# Altium project Flat_Log_UI.PrjPcb
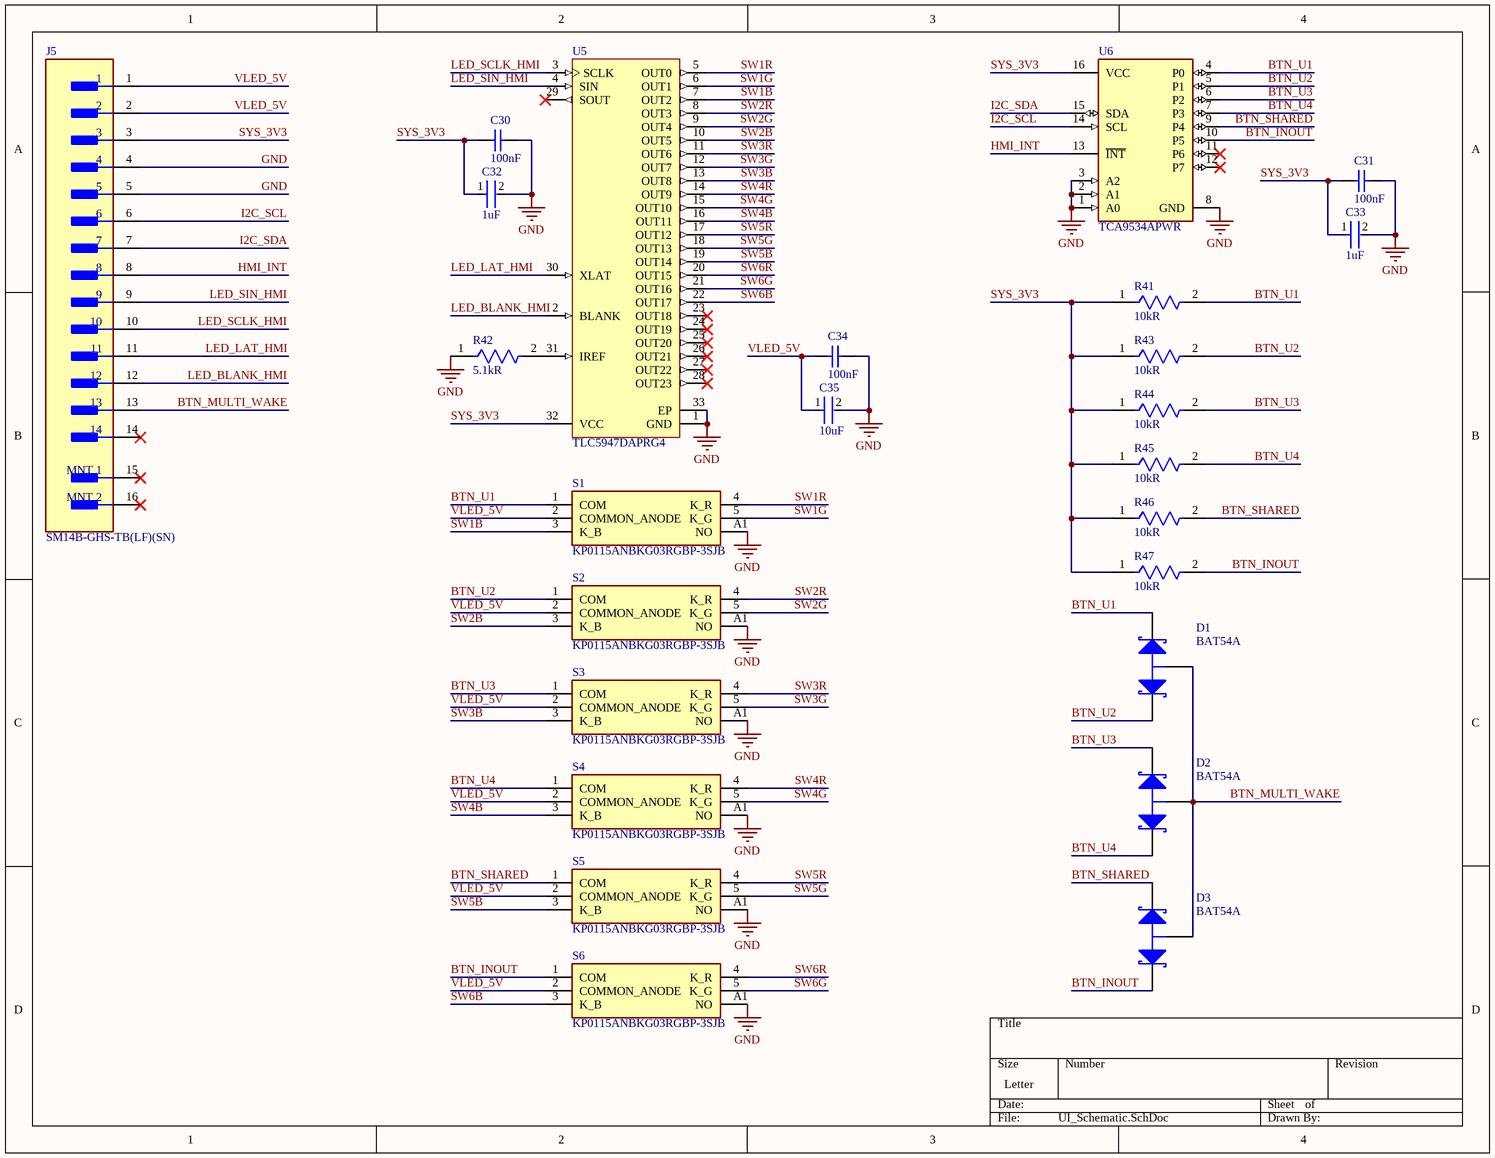
[diagram p0: UI_Schematic.SchDoc]
1 sheet, 25 parts. Net scope: global (net labels, ports and power ports of the same name join across sheets).
Board file: UI_PCB.PcbDoc

## Sheet UI_Schematic.SchDoc
size Letter; SheetNumber: 2; SheetTotal: 2

### Parts
C30  100nF  [CAPC1608X90X35ML10T15]
C31  100nF  [CAPC1608X90X35ML10T15]
C32  1uF  [FP-GRT188-0_1-e0_2_0_5-IPC_C]
C33  1uF  [FP-GRT188-0_1-e0_2_0_5-IPC_C]
C34  100nF  [CAPC1608X90X35ML10T15]
C35  10uF  [FP-GRM21B-0_15-IPC_A]
D1  BAT54A  [NXP-SOT23-3_V]
D2  BAT54A  [NXP-SOT23-3_V]
D3  BAT54A  [NXP-SOT23-3_V]
J5  SM14B-GHS-TB(LF)(SN)  [FP-SM14B-GHS-TB_LF_SN-MFG]
R41  10kR  [FP-AC0603-IPC_A]
R42  5.1kR  [FP-AT0603-IPC_B]
R43  10kR  [FP-AC0603-IPC_A]
R44  10kR  [FP-AC0603-IPC_A]
R45  10kR  [FP-AC0603-IPC_A]
R46  10kR  [FP-AC0603-IPC_A]
R47  10kR  [FP-AC0603-IPC_A]
S1  KP0115ANBKG03RGBP-3SJB  [KP0115ANBKG03RGBP3SJB]
S2  KP0115ANBKG03RGBP-3SJB  [KP0115ANBKG03RGBP3SJB]
S3  KP0115ANBKG03RGBP-3SJB  [KP0115ANBKG03RGBP3SJB]
S4  KP0115ANBKG03RGBP-3SJB  [KP0115ANBKG03RGBP3SJB]
S5  KP0115ANBKG03RGBP-3SJB  [KP0115ANBKG03RGBP3SJB]
S6  KP0115ANBKG03RGBP-3SJB  [KP0115ANBKG03RGBP3SJB]
U5  TLC5947DAPRG4  [TI-DAP32-3810X3710TP_N]
U6  TCA9534APWR  [FP-PW0016A-MFG]

### Nets
GND: C30.1 C31.1 C32.2 C33.2 C34.1 C35.2 J5.4 J5.5 R42.1 S1.A1(NO) S2.A1(NO) S3.A1(NO) S4.A1(NO) S5.A1(NO) S6.A1(NO) U5.1(GND) U5.33(EP) U6.1(A0) U6.2(A1) U6.3(A2) U6.8(GND)
BTN_INOUT: D3.2(K) R47.2 S6.1(COM) U6.10(P5)
BTN_MULTI_WAKE: D1.3(A) D2.3(A) D3.3(A) J5.13
BTN_SHARED: D3.1(K) R46.2 S5.1(COM) U6.9(P4)
BTN_U1: D1.1(K) R41.2 S1.1(COM) U6.4(P0)
BTN_U2: D1.2(K) R43.2 S2.1(COM) U6.5(P1)
BTN_U3: D2.1(K) R44.2 S3.1(COM) U6.6(P2)
BTN_U4: D2.2(K) R45.2 S4.1(COM) U6.7(P3)
HMI_INT: J5.8 U6.13(~{INT})
I2C_SCL: J5.6 U6.14(SCL)
I2C_SDA: J5.7 U6.15(SDA)
LED_BLANK_HMI: J5.12 U5.2(BLANK)
LED_LAT_HMI: J5.11 U5.30(XLAT)
LED_SCLK_HMI: J5.10 U5.3(SCLK)
LED_SIN_HMI: J5.9 U5.4(SIN)
SW1B: S1.3(K_B) U5.7(OUT2)
SW1G: S1.5(K_G) U5.6(OUT1)
SW1R: S1.4(K_R) U5.5(OUT0)
SW2B: S2.3(K_B) U5.10(OUT5)
SW2G: S2.5(K_G) U5.9(OUT4)
SW2R: S2.4(K_R) U5.8(OUT3)
SW3B: S3.3(K_B) U5.13(OUT8)
SW3G: S3.5(K_G) U5.12(OUT7)
SW3R: S3.4(K_R) U5.11(OUT6)
SW4B: S4.3(K_B) U5.16(OUT11)
SW4G: S4.5(K_G) U5.15(OUT10)
SW4R: S4.4(K_R) U5.14(OUT9)
SW5B: S5.3(K_B) U5.19(OUT14)
SW5G: S5.5(K_G) U5.18(OUT13)
SW5R: S5.4(K_R) U5.17(OUT12)
SW6B: S6.3(K_B) U5.22(OUT17)
SW6G: S6.5(K_G) U5.21(OUT16)
SW6R: S6.4(K_R) U5.20(OUT15)
SYS_3V3: C30.2 C31.2 C32.1 C33.1 J5.3 R41.1 R43.1 R44.1 R45.1 R46.1 R47.1 U5.32(VCC) U6.16(VCC)
VLED_5V: C34.2 C35.1 J5.1 J5.2 S1.2(COMMON_ANODE) S2.2(COMMON_ANODE) S3.2(COMMON_ANODE) S4.2(COMMON_ANODE) S5.2(COMMON_ANODE) S6.2(COMMON_ANODE)
NetR42_2: R42.2 U5.31(IREF)

Not connected (* = marked no-connect by the designer): J5 14* 15(MNT_1)* 16(MNT_2)*; U5 23(OUT18)* 24(OUT19)* 25(OUT20)* 26(OUT21)* 27(OUT22)* 28(OUT23)* 29(SOUT)*; U6 11(P6)* 12(P7)*

### Library data of the parts
C30 C31 C34 = CMP-2006-02375-5: Chip Capacitor, 100 nF, +/- 10%, 50 V, -55 to 125 degC, 0603 (1608 Metric), RoHS, Tape and Reel; Manufacturer: Murata; Voltage Rating: 50 V; Min Operating Temperature: -55 degC; ComponentLink1URL: http://www.murata.com/; PackageReference: 0603; Max Operating Temperature: 125 degC; ComponentLink1Description: Manufacturer URL; ComponentLink2Description: Datasheet; Packaging: Tape and Reel; PackageDescription: 2-Pin Surface Mount Device, Body 1.6 x 0.8 mm; Height: 0.8 mm; Mounting Technology: Surface Mount; Mount: Surface Mount; Length: 1.6 mm; ComponentLink2URL: http://psearch.en.murata.com/capacitor/product/GCM188R71H104KA57%23.pdf; Package Quantity: 4000; REACH SVHC: No SVHC; RoHSCompliant: true; DatasheetVersion: 07/2016
C32 C33 = CMP-06035-050353-1: Multi-Layer Ceramic Capacitor 1uF 25V X7R ±10% 0603 Paper T/R
C35 = CMP-06035-013048-1: Chip Multilayer Ceramic Capacitors for General Purpose, 0805, 10uF, X5R, 15%, 20%, 25V; Max Operating Temperature: 85°C; Package Quantity: 3000; Case/Package: 0805; Depth: 1.25mm; Case Code (Imperial): 0805; Termination: SMD/SMT; Width: 0.049inch; Packaging: Tape and Reel; Tolerance: 20%; Height: 1.25mm; Min Operating Temperature: -55°C; Capacitance: 10uF; Weight: 0.000335oz; Voltage Rating (DC): 25V; Dielectric: X5R; Length: 2mm; Thickness: 0.055inch; Voltage Rating: 25V; Resistor Type: Ceramic; Lead Free: Lead Free; Case Code (Metric): 2012; Mount: Surface Mount; REACH SVHC: No SVHC
D1-D3 = CMP-0417-00002-1: Schottky Barrier Diode, 30 V, 2 uA, -55 to 150 degC, 3-Pin SOT23, RoHS, Tape and Reel; Manufacturer: NXP Semiconductors; VF (mV): 800; Trr (ns): 5; Rth(j-a) (K/W): 500; VR (V): 30; Cd (pF): 10; IR (uA): 2; PackageDescription: 3-Pin Plastic Surface-mounted Package, Body 1.3 x 2.9 mm, Pitch 0.95 mm; PartNumber: BAT54A; Packing: Tape and Reel; ComponentLink1Description: Manufacturer URL; ComponentLink2Description: Datasheet; PackageReference: SOT23-3; ComponentLink2URL: http://www.nxp.com/documents/data_sheet/BAT54_SER.pdf; Temperature Range: -55 to 150 degC; RoHS: TRUE; Mounting Technology: Surface Mount; ComponentLink1URL: http://www.nxp.com/; DatasheetVersion: Rev. 5
J5 = CMP-17439-000618-1: CONN HEADER SMD R/A 14POS 1.25MM; Wire/Cable Gauge: 26AWG; Current Rating: 1A; Number of Contacts: 14; Voltage Rating: 50V; Gender: Male; Number of Rows: 1; Housing Material: Nylon; Insulation Material: Nylon; Reach SVHC Compliant: Yes; Pitch: 1.25mm; Series: GH; Lead Free: Lead Free; Contact Finish - Mating: TIN; Mount: Surface Mount; Contact Type: Outer Shroud Contact; Flammability Rating: UL94 V-0; Fastening Type: Ramp; Number of Positions: 14; Contact Material: Bronze; Termination: Solder; Package Quantity: 2500; Connector Type: Header; Max Operating Temperature: 85°C; Housing Color: Natural; Color: Natural; Contact Shape: Rectangular; Min Operating Temperature: -25°C; Contact Plating: Tin; Packaging: Cut Tape; Insulation Color: Natural; Voltage Rating (AC): 50V
R41 R43-R47 = CMP-03412-040683-1: RES 10kΩ 5.00% 0.2W 0603
R42 = CMP-03412-047308-1: Thin Film Chip Resistors Automotive Grade 5.1kΩ 1% 50ppm/°C 0603
S1-S6 = KP0115ANBKG03RGBP-3SJB: Switch; Manufacturer_Name: NKK Switches; Datasheet Link: https://www.nkkswitches.com/wp-content/themes/impress-blank/search/inc/parts.php?part_no=KP0115ANBKG03RGBP-3FJB; Height: 23mm; Manufacturer_Part_Number: KP0115ANBKG03RGBP-3SJB; Mouser Part Number: 633-5ANBKG03RGBP3SJB; Mouser Price/Stock: https://www.mouser.co.uk/ProductDetail/NKK-Switches/KP0115ANBKG03RGBP-3SJB?qs=u16ybLDytRbS46rqp2jE%2Fg%3D%3D
U5 = CMP-0388-00088-1: 24-Channel, 12-Bit PWM LED Driver with Internal Oscillator, 3 to 5.5 V, -40 to 85 degC, 32-pin SOP (DAP32), Green (RoHS & no Sb/Br); Manufacturer: Texas Instruments; Rating: Catalog; Vin(Max)(V): 5.5; Vin(Min)(V): 3; PartNumber: TLC5947DAPRG4; ComponentLink2Description: Datasheet; SubFamily: LED Driver; ComponentLink1Description: Manufacturer URL; ComponentLink2URL: http://www.ti.com/general/docs/lit/getliterature.tsp?genericPartNumber=TLC5947&fileType=pdf; Eco-Plan: Green (RoHS & no Sb/Br); PackageDescription: 32-pin Plastic Small Outline, Body 11 x 6.1 mm, Pitch 0.65 mm; Code_JEDEC: MO-153; PackageReference: DAP32-3810X3710TP; Mounting Technology: Surface Mount; DatasheetVersion: SBVS114A; ComponentLink1URL: http://www.ti.com/; ComponentLink3URL: http://www.ti.com/litv/pdf/mpds380; PackageVersion: 4073257-4/E; ComponentLink3Description: Package Specification
U6 = CMP-04886-000001-1: IC I/O EXPANDER I2C 8B 16TSSOP; Manufacturer: Texas Instruments; Max Junction Temp: 100°C; Interface: I2C,SMBus; Standoff Height: 0.05mm; Nominal Supply Current: 5-22uA; Number Of I/Os: 8; Max Supply Voltage: 5.5V; Min Supply Voltage: 1.65V; Frequency: 400kHz; Device Class L3: I/O Expanders; Octopart: https://octopart.com/tca9534apwr-texas+instruments-50333529; ComponentLink2URL: http://www.ti.com/lit/ds/symlink/tca9534a.pdf; ComponentLink2Description: Datasheet; Ambient Temperature Range Low: -40°C; Manufacturer Part Number: TCA9534APWR; Lead Free: Yes; Category: IC; Package: PW0016A; Automotive: No; Temperature Range Low: -40°C; Temperature Range High: +85°C; Device Class L2: Interface ICs; Temperature: -40°C to +85°C; RoHS: TRUE; Height: 1.2mm; Digikey Description: IC I/O EXPANDER I2C 8B 16TSSOP; Device Class L1: Integrated Circuits (ICs); Ambient Temperature Range High: +85°C